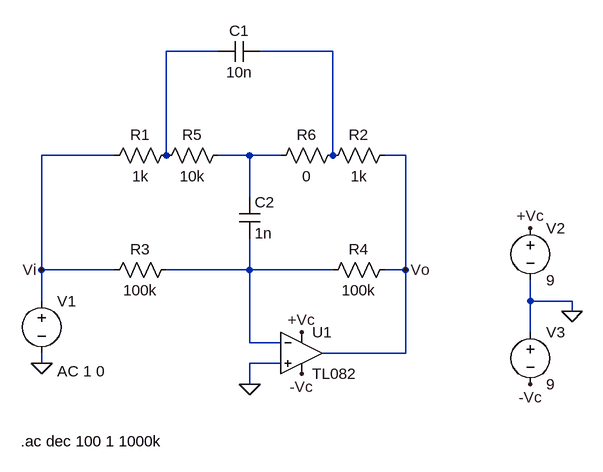
[diagram p0: schematic Ej4.asc]
Ej4.asc, the LTspice schematic file:
Version 4
SHEET 1 880 680
WIRE 192 -32 112 -32
WIRE 368 -32 256 -32
WIRE 32 128 -80 128
WIRE 112 128 112 -32
WIRE 240 128 192 128
WIRE 288 128 240 128
WIRE 368 128 368 -32
WIRE 480 128 448 128
WIRE 240 192 240 128
WIRE -80 304 -80 128
WIRE 32 304 -80 304
WIRE 240 304 240 256
WIRE 240 304 112 304
WIRE 368 304 240 304
WIRE 480 304 480 128
WIRE 480 304 448 304
WIRE -80 352 -80 304
WIRE 672 352 672 320
WIRE 736 352 672 352
WIRE 736 368 736 352
WIRE 672 400 672 352
WIRE 240 416 240 304
WIRE 288 416 240 416
WIRE 480 432 480 304
WIRE 480 432 352 432
WIRE -80 448 -80 432
WIRE 288 448 240 448
WIRE 240 480 240 448
FLAG 240 480 0
FLAG -80 448 0
FLAG 736 368 0
FLAG -80 304 Vi
FLAG 480 304 Vo
FLAG 320 400 +Vc
FLAG 320 464 -Vc
FLAG 672 240 +Vc
FLAG 672 480 -Vc
SYMBOL res 128 112 R90
WINDOW 0 0 56 VBottom 2
WINDOW 3 32 56 VTop 2
SYMATTR InstName R1
SYMATTR Value 1k
SYMBOL res 464 112 R90
WINDOW 0 0 56 VBottom 2
WINDOW 3 32 56 VTop 2
SYMATTR InstName R2
SYMATTR Value 1k
SYMBOL res 128 288 R90
WINDOW 0 0 56 VBottom 2
WINDOW 3 32 56 VTop 2
SYMATTR InstName R3
SYMATTR Value 100k
SYMBOL res 464 288 R90
WINDOW 0 0 56 VBottom 2
WINDOW 3 32 56 VTop 2
SYMATTR InstName R4
SYMATTR Value 100k
SYMBOL cap 224 192 R0
SYMATTR InstName C2
SYMATTR Value 1n
SYMBOL cap 256 -48 R90
WINDOW 0 0 32 VBottom 2
WINDOW 3 32 32 VTop 2
SYMATTR InstName C1
SYMATTR Value 10n
SYMBOL PAULOlib\\TL082 320 368 R0
SYMATTR InstName U1
SYMBOL voltage -80 336 R0
WINDOW 123 24 124 Left 2
WINDOW 39 0 0 Left 0
SYMATTR Value2 AC 1 0
SYMATTR InstName V1
SYMATTR Value ""
SYMBOL voltage 672 224 R0
WINDOW 123 0 0 Left 0
WINDOW 39 0 0 Left 0
SYMATTR InstName V2
SYMATTR Value 9
SYMBOL voltage 672 384 R0
WINDOW 123 0 0 Left 0
WINDOW 39 0 0 Left 0
SYMATTR InstName V3
SYMATTR Value 9
SYMBOL res 208 112 R90
WINDOW 0 0 56 VBottom 2
WINDOW 3 32 56 VTop 2
SYMATTR InstName R5
SYMATTR Value 10k
SYMBOL res 384 112 R90
WINDOW 0 0 56 VBottom 2
WINDOW 3 32 56 VTop 2
SYMATTR InstName R6
SYMATTR Value 0
TEXT -112 568 Left 2 !.ac dec 100 1 1000k

The netlist it stands for:
* Ej4.asc
R1 N001 Vi 1k
R2 Vo N002 1k
R3 N004 Vi 100k
R4 Vo N004 100k
C2 N003 N004 1n
C1 N002 N001 10n
* U1: TL082 (symbol PAULOlib\TL082 not available, pins judged from their places): In+=0 In-=N004 V+=+Vc V-=-Vc OUT=Vo
V1 Vi 0 AC 1 0
V2 +Vc 0 9
V3 0 -Vc 9
R5 N003 N001 10k
R6 N002 N003 0
.ac dec 100 1 1000k
.backanno
.end